# Altium project EH.PrjPcb
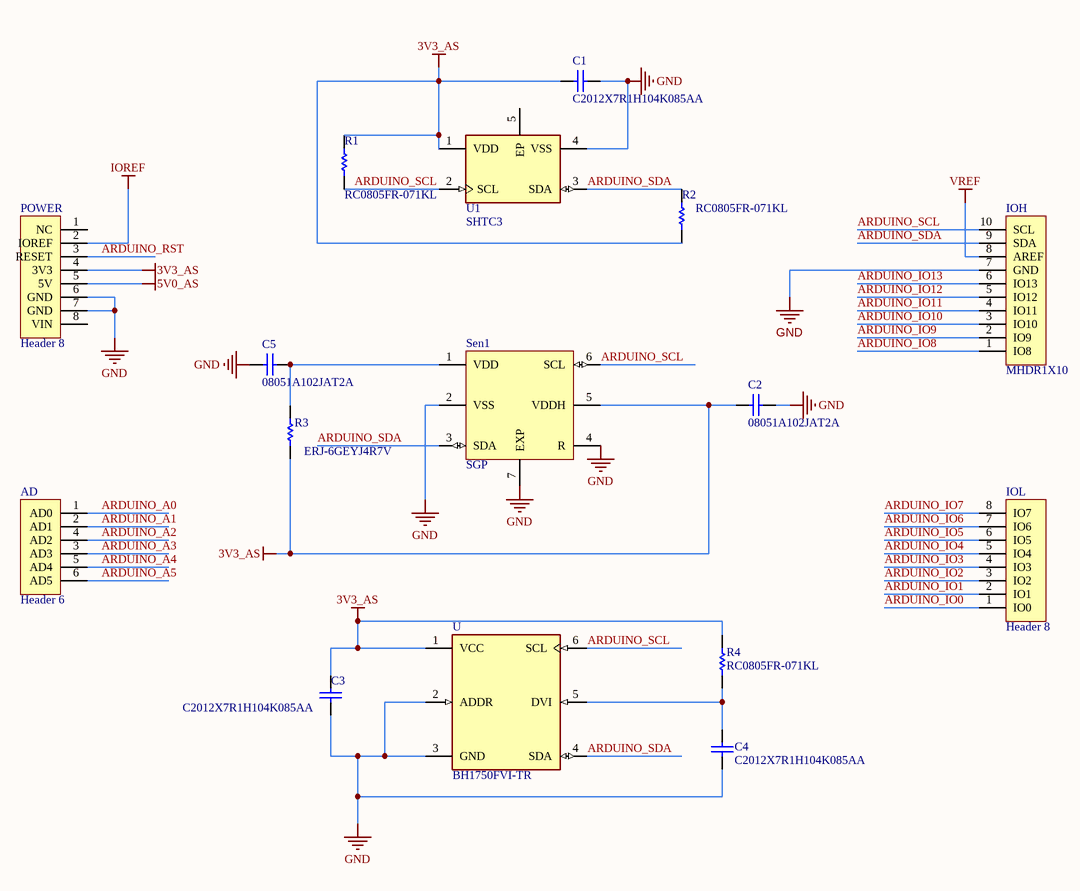
[diagram p0: Minized.SchDoc]
1 sheet, 16 parts. Net scope: global (net labels, ports and power ports of the same name join across sheets).
Board file: ARDUINO.PcbDoc

## Sheet Minized.SchDoc
size A4; Organization: Altium Limited; Address1: L3, 12a Rodborough Rd; Address2: Frenchs Forest; Address3: NSW; Address4: Australia 2086

### Parts
AD  Header 6  [HDR1X6]
C1  C2012X7R1H104K085AA  [CAPC2013X145X20LL20]
C2  08051A102JAT2A  [CAPC2013X140X50NL20T25]
C3  C2012X7R1H104K085AA  [CAPC2013X145X20LL20]
C4  C2012X7R1H104K085AA  [CAPC2013X145X20LL20]
C5  08051A102JAT2A  [CAPC2013X140X50NL20T25]
IOH  MHDR1X10  [MHDR1X10]
IOL  Header 8  [HDR1X8]
POWER  Header 8  [HDR1X8]
R1  RC0805FR-071KL  [RESC2013X60X35ML10T20]
R2  RC0805FR-071KL  [RESC2013X60X35ML10T20]
R3  ERJ-6GEYJ4R7V  [RESC2013X70X40LL20T20]
R4  RC0805FR-071KL  [RESC2013X60X35ML10T20]
Sen1  SGP  [SGPx4x]
U  BH1750FVI-TR  [XDCR_BH1750FVI-TR]
U1  SHTC3  [FP-SHTC3-MFG]

### Nets
3V3_AS: C1.1 C2.2 C3.2 POWER.4(3V3) R1.2 R2.1 R3.1 R4.2 Sen1.5(VDDH) U.1(VCC) U1.1(VDD)
5V0_AS: POWER.5(5V)
GND: C1.2 C2.1 C3.1 C4.1 C5.1 IOH.7(GND) POWER.6(GND) POWER.7(GND) Sen1.2(VSS) Sen1.4(R) Sen1.7(EXP) U.2(ADDR) U.3(GND) U1.4(VSS)
IOREF: POWER.2(IOREF)
VREF: IOH.8(AREF)
ARDUINO_A0: AD.1(AD0)
ARDUINO_A1: AD.2(AD1)
ARDUINO_A2: AD.4(AD2)
ARDUINO_A3: AD.3(AD3)
ARDUINO_A4: AD.5(AD4)
ARDUINO_A5: AD.6(AD5)
ARDUINO_IO0: IOL.1(IO0)
ARDUINO_IO1: IOL.2(IO1)
ARDUINO_IO2: IOL.3(IO2)
ARDUINO_IO3: IOL.4(IO3)
ARDUINO_IO4: IOL.5(IO4)
ARDUINO_IO5: IOL.6(IO5)
ARDUINO_IO6: IOL.7(IO6)
ARDUINO_IO7: IOL.8(IO7)
ARDUINO_IO8: IOH.1(IO8)
ARDUINO_IO9: IOH.2(IO9)
ARDUINO_IO10: IOH.3(IO10)
ARDUINO_IO11: IOH.4(IO11)
ARDUINO_IO12: IOH.5(IO12)
ARDUINO_IO13: IOH.6(IO13)
ARDUINO_RST: POWER.3(RESET)
ARDUINO_SCL: IOH.10(SCL) R1.1 Sen1.6(SCL) U.6(SCL) U1.2(SCL)
ARDUINO_SDA: IOH.9(SDA) R2.2 Sen1.3(SDA) U.4(SDA) U1.3(SDA)
NetC4_2: C4.2 R4.1 U.5(DVI)
NetC5_2: C5.2 R3.2 Sen1.1(VDD)

Not connected (* = marked no-connect by the designer): POWER 1(NC) 8(VIN); U1 5(EP)

### Notes on the sheet
- Title
- Size:
- Date:
- A4
- Number:
- Time:
- Revision:
- Sheet
- of
- File:

### Library data of the parts
AD = Header 6: Header, 6-Pin; LatestRevisionDate: 17-Jul-2002; LatestRevisionNote: Re-released for DXP Platform.; Publisher: Altium Limited
C1 C3 C4 = CMP-2000-07557-1: Chip Capacitor, 0.1 uF, +/- 10%, 50 V, -55 to 125 degC, 0805 (2012 Metric), RoHS, Tape and Reel; Manufacturer: TDK; Voltage Rating: 50V; Dielectric Material: Ceramic; Capacitance: 100nF; Dielectric: X7R; Datasheet Version: 07/2017; Max Operating Temperature: 125degC; RoHSCompliant: True; Min Operating Temperature: -55degC; Case/Package: 0805; Composition: Ceramic; Width: 0.049inch; Thickness: 0.037inch; Datasheet URL: https://product.tdk.com/info/en/catalog/datasheets/mlcc_commercial_general_en.pdf; Height: 0.85mm; Voltage Rating (DC): 50V; Voltage: 50V; Packaging: TapeandReel; Mounting Technology: SurfaceMount; Case Code (Metric): 2012; Length: 2mm; Radiation Hardening: No; Number of Pins: 2; REACH SVHC: NoSVHC; Lead Free: LeadFree; Package Reference: 805; Weight: 0.000194oz; Tolerance: 10%; Package Description: 2-Pin Surface Mount Device, Body 2 x 1.25 mm; Manufacturer URL: http://www.tdk.com/; Package Quantity: 1; Case Code (Imperial): 0805; Mount: SurfaceMount; Depth: 1.25mm; Termination: SMD/SMT
C2 C5 = CMP-2007-04527-1: Manufacturer: AVX Interconnect / Elco; Part Number: 08051A102JAT2A
IOH = MHDR1X10: Header, 10-Pin; LatestRevisionDate: 17-Jul-2002; LatestRevisionNote: Re-released for DXP Platform.; Publisher: Altium Limited
IOL POWER = Header 8: Header, 8-Pin; LatestRevisionDate: 17-Jul-2002; LatestRevisionNote: Re-released for DXP Platform.; Publisher: Altium Limited
R1 R2 R4 = CMP-2100-03671-1: Chip Resistor, 1 KOhm, +/- 1%, 125 mW, -55 to 155 degC, 0805 (2012 Metric), RoHS, Tape and Reel; Manufacturer: Yageo; Temperature Coefficient: 100ppm/degreesC; Voltage Rating (DC): 150V; Max Power Dissipation: 125mW; Resistance: 1KOhm; Number of Pins: 2; Number of Terminations: 2; Datasheet URL: http://www.yageo.com/NewPortal/yageodocoutput?fileName=/pdf/R-Chip/PYu-RC_Group_51_RoHS_L_5.pdf; Length: 0.079inch; Package Description: 2-Pin Surface Mounted Device, Body 2 x 1.25 mm; Depth: 1.25mm; Height: 0.024inch; Military Standard: Not; Case/Package: 0805; Package Reference: 0805; RoHSCompliant: true; Lead Free: LeadFree; Packaging: TapeandReel; Package Quantity: 1; Datasheet Version: Rev. 5, 10/2016; Tolerance: 1%; Min Operating Temperature: -55degC; Voltage Rating: 150V; Composition: ThickFilm; Case Code (Imperial): 0805; Power Rating: 125mW; Width: 0.049inch; Case Code (Metric): 2012; Manufacturer URL: http://www.yageo.com/; Max Operating Temperature: 155degC; REACH SVHC: Unknown; Termination: SMD/SMT
R3 = CMP-2001-00424-1: Manufacturer: Panasonic; Part Number: ERJ-6GEYJ4R7V
U = BH1750FVI-TR: Optical Sensor Ambient 560nm IÂ²C 6-SMD, Flat Lead Exposed Pad; MF: Rohm; SnapEDA_Link: https://www.snapeda.com/parts/BH1750FVI-TR/Rohm/view-part/106507/?ref=snap; MP: BH1750FVI-TR; Price: None; Value: *; Availability: Unavailable; Package: SMD-6 Rohm
U1 = CMP-144040-000003-1: SENSOR HUMI/TEMP I2C 2% SMD; Manufacturer: Sensirion; Operating Supply Current: 0.3-900uA; Resolution: 16bits; Min Supply Voltage: 1.62V; Max Supply Voltage: 3.6V; Category: IC; Device Class L3: unset; ComponentLink2URL: https://www.sensirion.com/fileadmin/user_upload/customers/sensirion/Dokumente/0_Datasheets/Humidity/Sensirion_Humidity_Sensors_SHTC3_Datasheet.pdf; Ipc Land Pattern Name: DFN200X200X75-4; RoHS: TRUE; Height: 0.75mm; Interface: I2C; Temperature Range High: +125°C; Accuracy: 2%; Sensor Output: I2C; Automotive: No; Package: 0; Device Class L1: Sensors; Manufacturer Part Number: SHTC3; Digikey Description: SENSOR HUMI/TEMP I2C 2% SMD; Lead Free: Yes; Temperature: -40°C to +125°C; Device Class L2: Temperature and Humidity Sensors; ComponentLink2Description: Datasheet; Octopart: https://octopart.com/shtc3-sensirion-91912225; Mouser Description: SHTC3 Series 0 to 100% RH 3.6 V Humidity and Temperature Sensor IC - DFN-4; Temperature Range Low: -40°C